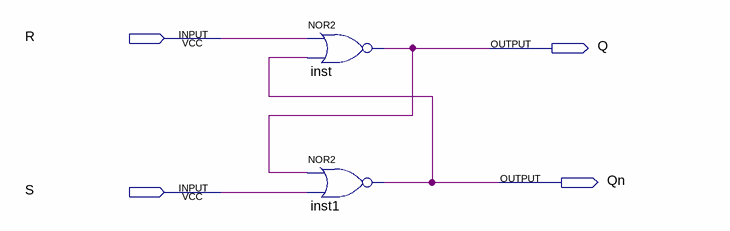
[diagram p0: schematic sheet]
// Quartus schematic SR.bdf as structural Verilog: 2 symbols, 4 pins
module SR (
  input  R,
  input  S,
  output Q,
  output Qn
);

  nor inst (Q, R, Qn);
  nor inst1 (Qn, Q, S);
endmodule
